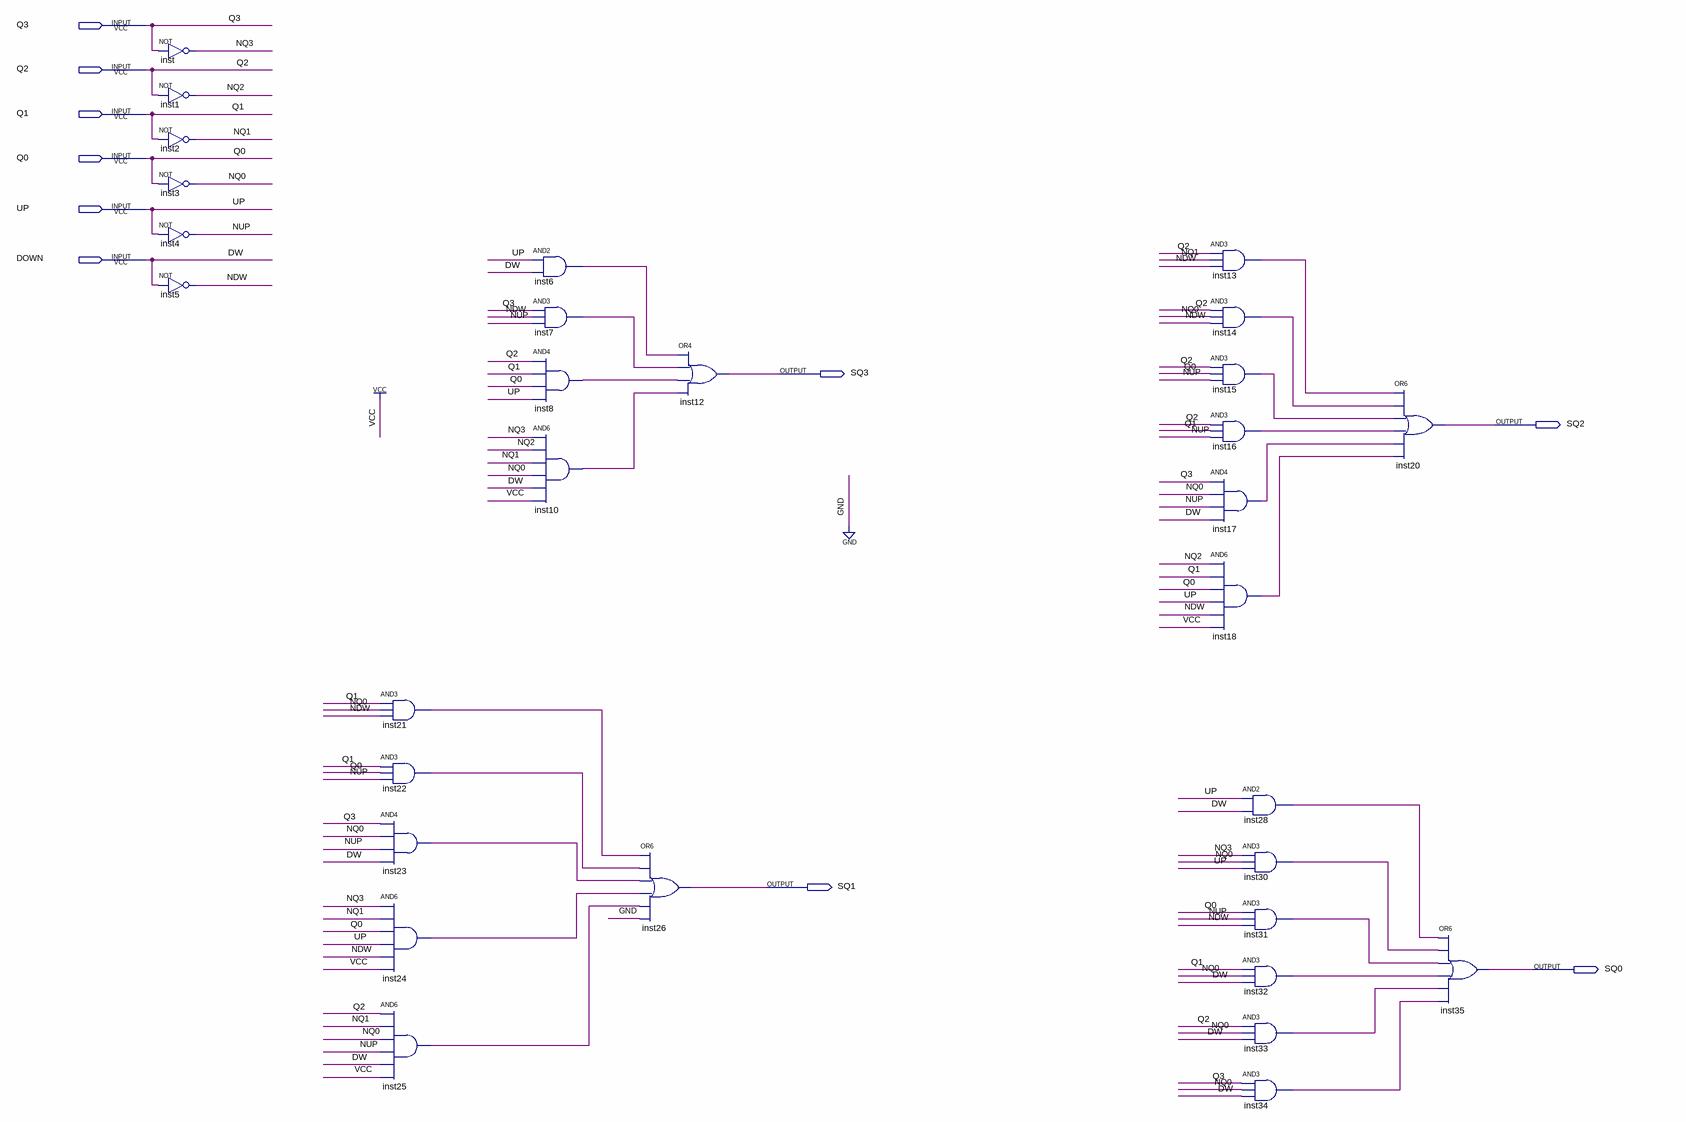
[diagram p0: schematic sheet]
// Quartus schematic CC1.bdf as structural Verilog: 31 symbols, 10 pins
module CC1 (
  input  Q3,
  input  Q2,
  input  Q1,
  input  Q0,
  input  UP,
  input  DOWN,
  output SQ3,
  output SQ2,
  output SQ1,
  output SQ0
);

  wire inst6_out, inst7_out, inst8_out, inst10_out, inst13_out, inst14_out, inst15_out, inst16_out,
       inst17_out, inst18_out, inst21_out, inst22_out, inst23_out, inst24_out, inst25_out, inst28_out,
       inst30_out, inst31_out, inst32_out, inst33_out, inst34_out, NDW, NQ0, NQ1, NQ2, NQ3, NUP;

  not inst (NQ3, Q3);
  not inst1 (NQ2, Q2);
  not inst2 (NQ1, Q1);
  not inst3 (NQ0, Q0);
  not inst4 (NUP, UP);
  not inst5 (NDW, DOWN);
  and inst21 (inst21_out, Q1, NQ0, NDW);
  and inst22 (inst22_out, Q1, Q0, NUP);
  and inst23 (inst23_out, Q3, NQ0, NUP, DOWN);
  and inst24 (inst24_out, NQ3, NQ1, Q0, UP, NDW, 1'b1);
  and inst25 (inst25_out, Q2, NQ1, NQ0, NUP, DOWN, 1'b1);
  and inst6 (inst6_out, UP, DOWN);
  and inst7 (inst7_out, Q3, NDW, NUP);
  and inst8 (inst8_out, Q2, Q1, Q0, UP);
  and inst10 (inst10_out, NQ3, NQ2, NQ1, NQ0, DOWN, 1'b1);
  or inst26 (SQ1, inst21_out, inst22_out, inst23_out, inst24_out, inst25_out, 1'b0);
  or inst12 (SQ3, inst6_out, inst7_out, inst8_out, inst10_out);
  and inst13 (inst13_out, Q2, NQ1, NDW);
  and inst14 (inst14_out, Q2, NQ0, NDW);
  and inst15 (inst15_out, Q2, Q0, NUP);
  and inst16 (inst16_out, Q2, Q1, NUP);
  and inst17 (inst17_out, Q3, NQ0, NUP, DOWN);
  and inst18 (inst18_out, NQ2, Q1, Q0, UP, NDW, 1'b1);
  and inst28 (inst28_out, UP, DOWN);
  and inst30 (inst30_out, NQ3, NQ0, UP);
  and inst31 (inst31_out, Q0, NUP, NDW);
  and inst32 (inst32_out, Q1, NQ0, DOWN);
  and inst33 (inst33_out, Q2, NQ0, DOWN);
  and inst34 (inst34_out, Q3, NQ0, DOWN);
  or inst20 (SQ2, inst13_out, inst14_out, inst15_out, inst16_out, inst17_out, inst18_out);
  or inst35 (SQ0, inst28_out, inst30_out, inst31_out, inst32_out, inst33_out, inst34_out);

  // Other names for the same wires on the sheet: DW = DOWN
endmodule
